# EAGLE design DC_DC_V1.4.2-2(bottom) (EAGLE 7.7.0)
CNAME: DC/DC board for 2016-2017; CREVISION: V1.3; DESIGNER: Sylvia Fu
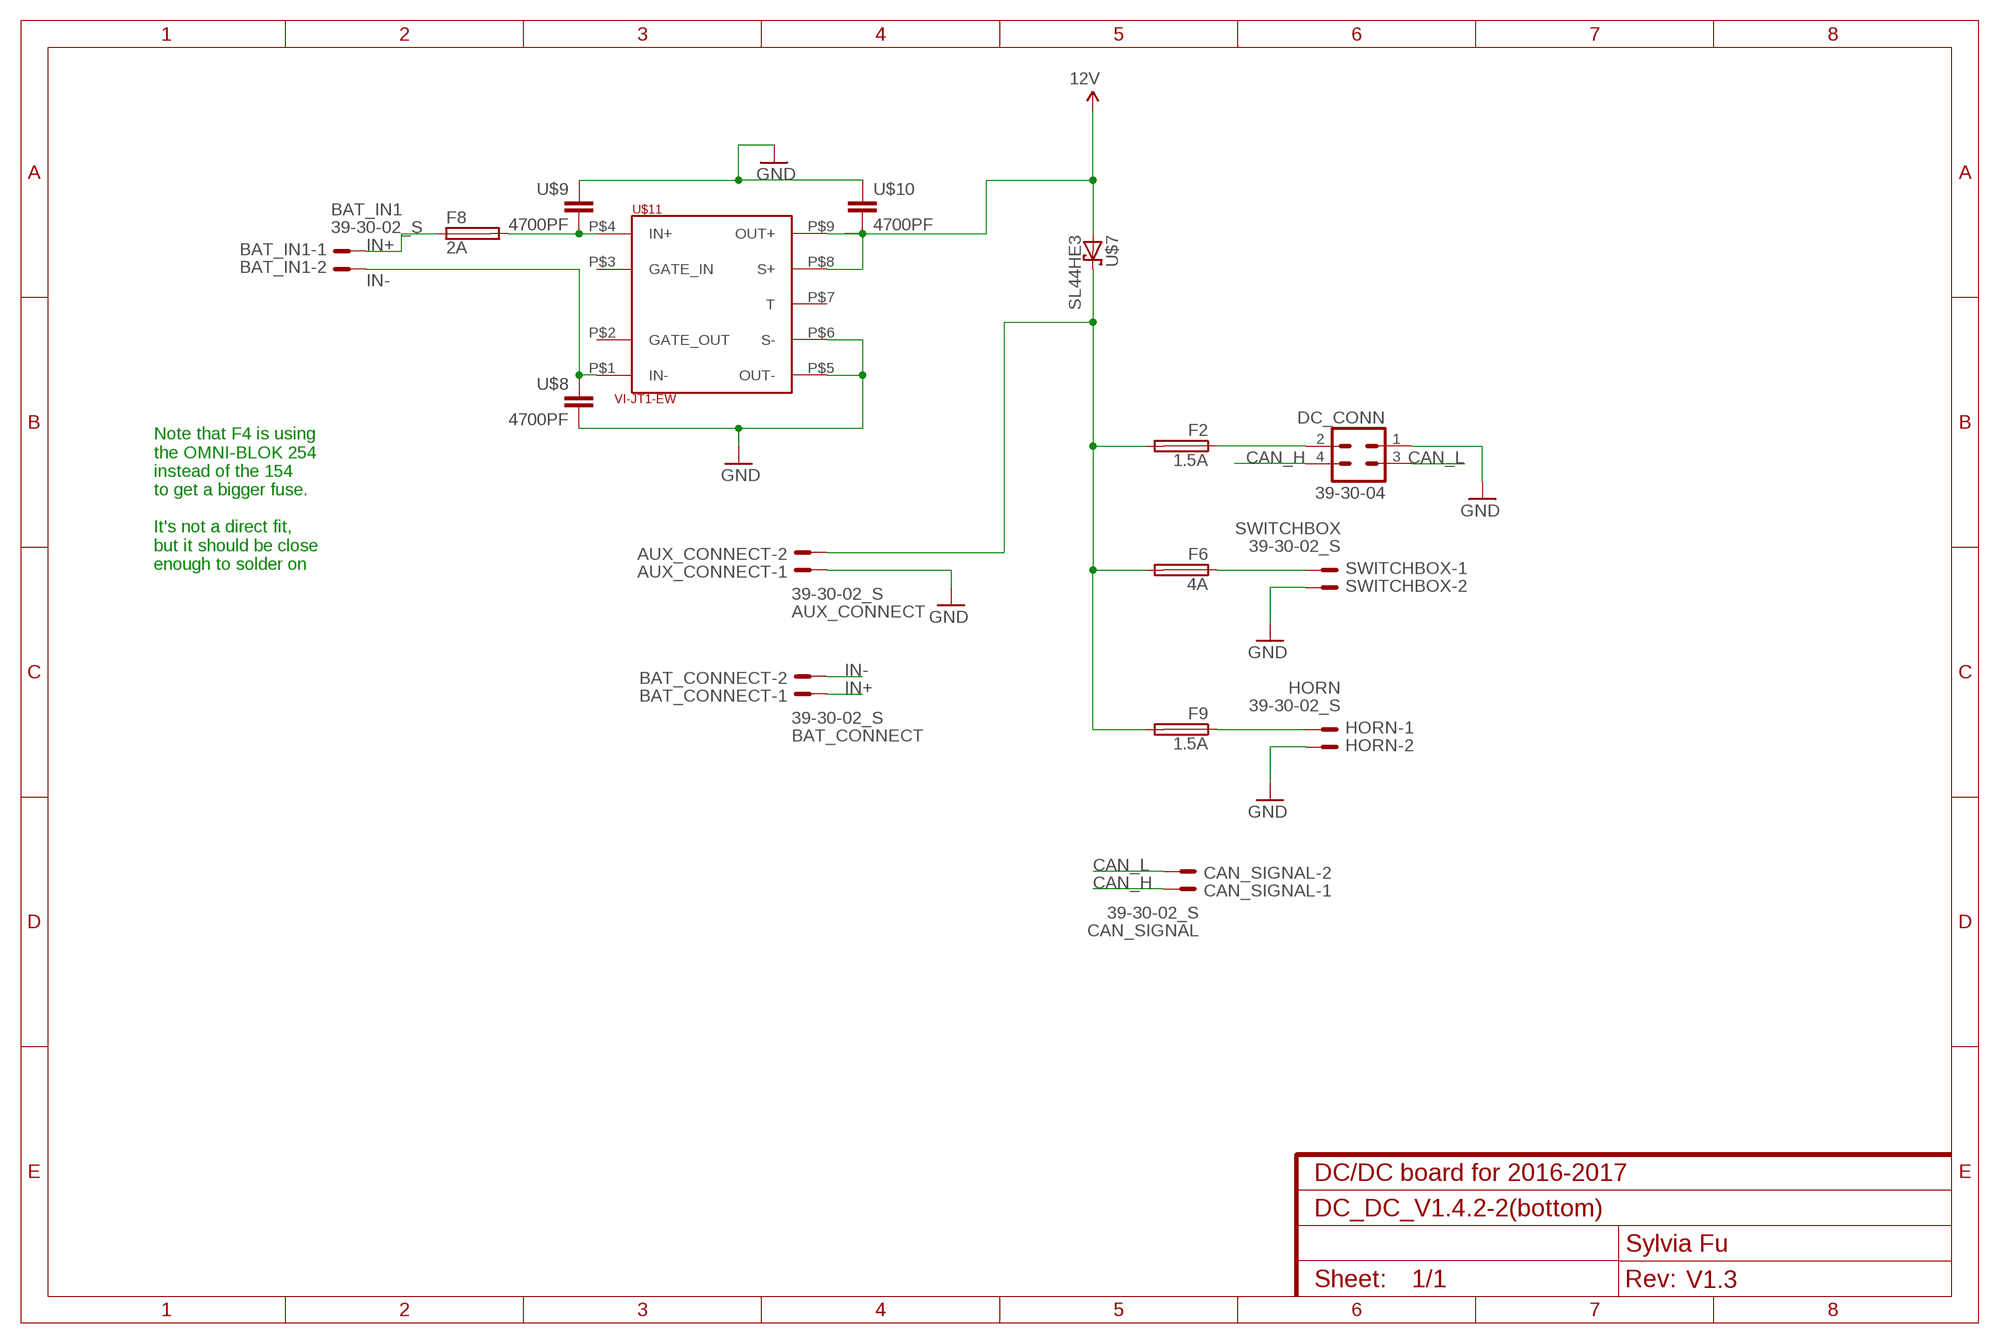
[diagram p0: schematic, sheet 1]

## Parts
AUX_CONNECT  39-30-02_S  [39-30-?02?]
BAT_CONNECT  39-30-02_S  [39-30-?02?]
BAT_IN1  39-30-02_S  [39-30-?02?]
CAN_SIGNAL  39-30-02_S  [39-30-?02?]
DC_CONN  39-30-04  [39-30-?04?]
F2  1.5A  SMD-MICRO-FUSE-BLOCK  [OMNIBLOK]
F6  4A  SMD-MICRO-FUSE-BLOCK  [OMNIBLOK]
F8  2A  SMD-MICRO-FUSE-BLOCK  [OMNIBLOK]
F9  1.5A  SMD-MICRO-FUSE-BLOCK  [OMNIBLOK]
HORN  39-30-02_S  [39-30-?02?]
SWITCHBOX  39-30-02_S  [39-30-?02?]
U$7  SL44HE3  [SMC]
U$8  4700PF  [Y2_CAP]
U$9  4700PF  [Y2_CAP]
U$10  4700PF  [Y2_CAP]
U$11  VI-JT1-EW  [VI-J00]

## Nets
12V: U$7.A U$10.P$2 U$11.P$8(S+) U$11.P$9(OUT+)
CAN_H: CAN_SIGNAL.1 DC_CONN.4
CAN_L: CAN_SIGNAL.2 DC_CONN.3
GND: AUX_CONNECT.1 DC_CONN.1 HORN.2 SWITCHBOX.2 U$8.P$2 U$9.P$1 U$10.P$1 U$11.P$5(OUT-) U$11.P$6(S-)
IN+: BAT_CONNECT.1 BAT_IN1.1 F8.P$1
IN-: BAT_CONNECT.2 BAT_IN1.2 U$8.P$1 U$11.P$1(IN-)
N$1: AUX_CONNECT.2 F2.P$2 F6.P$2 F9.P$2 U$7.C
N$5: DC_CONN.2 F2.P$1
N$8: F6.P$1 SWITCHBOX.1
N$11: F9.P$1 HORN.1
N$12: F8.P$2 U$9.P$2 U$11.P$4(IN+)
Unconnected: U$11.P$2(GATE_OUT) U$11.P$3(GATE_IN) U$11.P$7(T)

## Notes on the sheet
- Note that F4 is using
  the OMNI-BLOK 254
  instead of the 154
  to get a bigger fuse.
  
  It's not a direct fit,
  but it should be close
  enough to solder on

## Library data of the parts
AUX_CONNECT BAT_CONNECT BAT_IN1 CAN_SIGNAL HORN SWITCHBOX = con-molex-mini-fit:39-30-?02?_S: HEADER
DC_CONN = con-molex-mini-fit:39-30-?04?: HEADER
F2 F6 F8 F9 = f-lf-omniblok-s:SMD-MICRO-FUSE
U$7 = diode:SL44HE3
U$8-U$10 = NUSOLAR_Custom:4700PF
U$11 = NUSOLAR_Custom:VI-JT1-EW

## Board
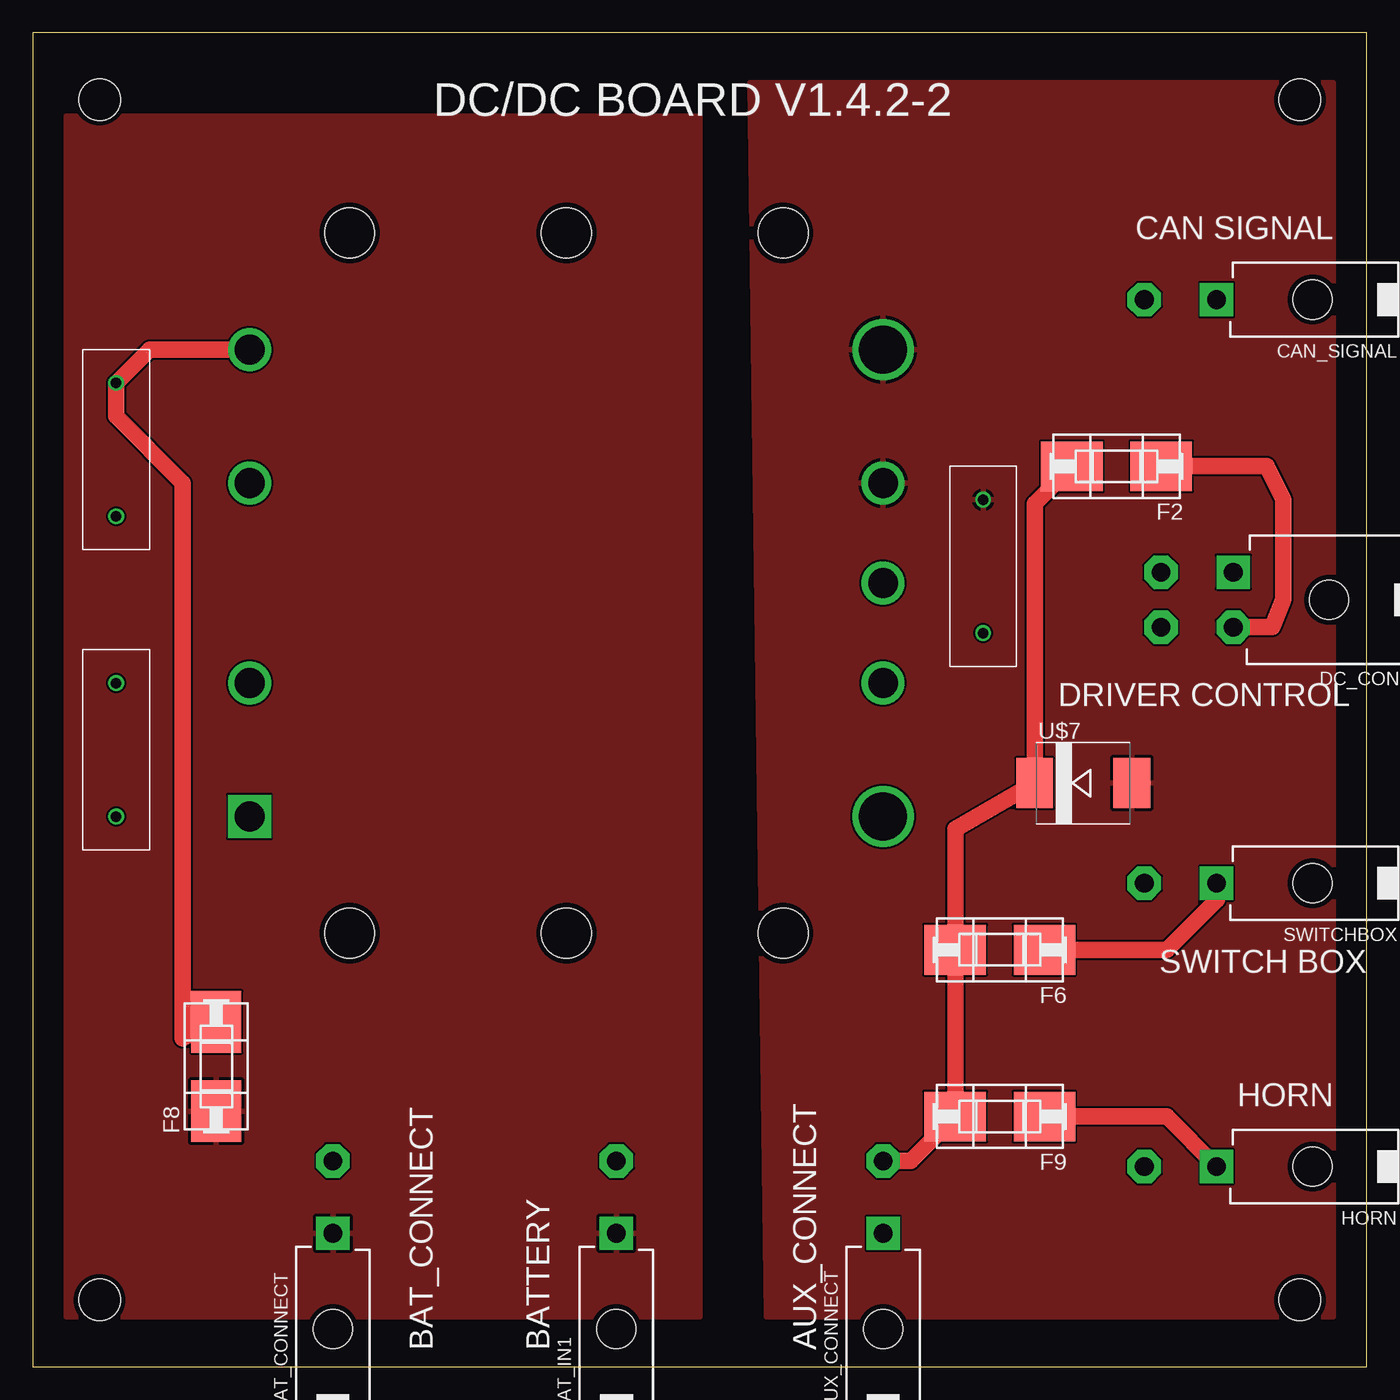
[diagram p1: board, top side]
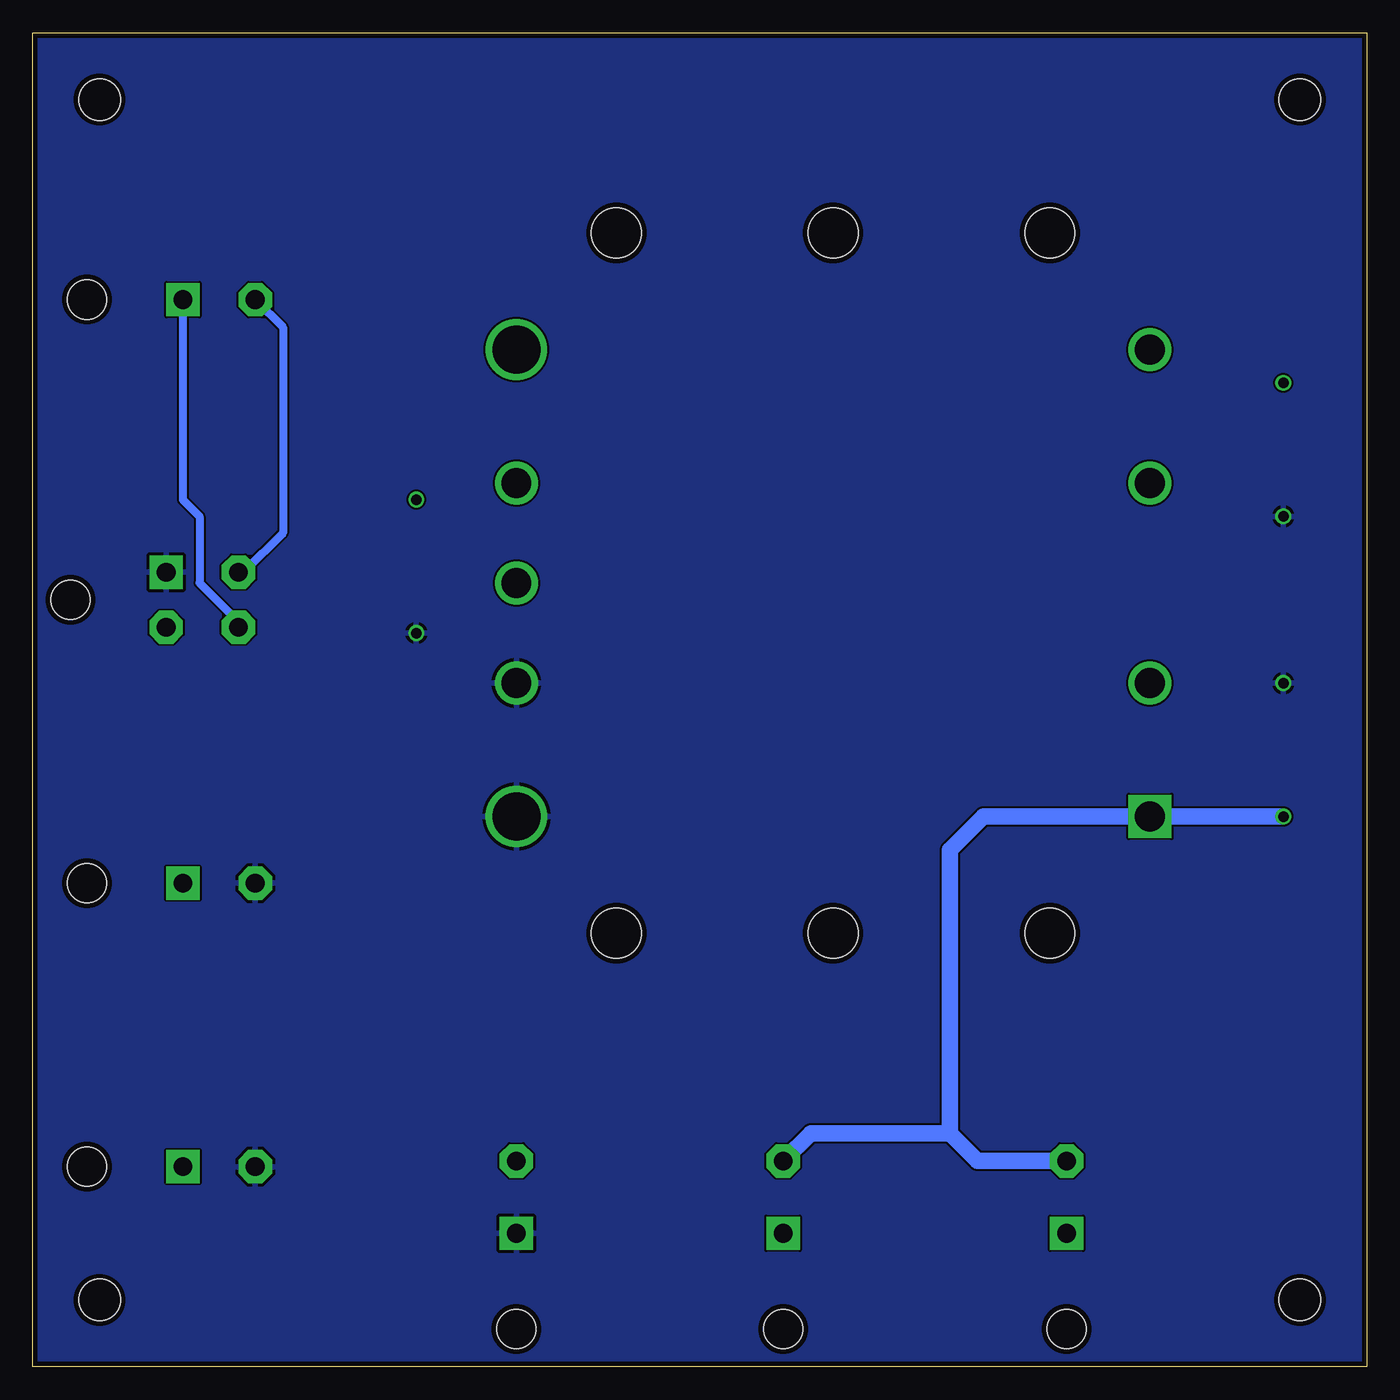
[diagram p2: board, bottom side, seen from below]

Size 101.6 x 101.6 mm. Coordinates in mm from the lower left corner, seen from the top.
Outline: 0,0 101.6,0 101.6,101.6 0,101.6 0,0
Copper layers (1*16): Top 0.0356mm / dielectric 1.5011mm / Bottom 0.0356mm
Design rules "LaenPCBOrder": minimum track width 6mil, minimum drill 13mil, track to track 6mil, track to pad 6mil, pad to pad 6mil, via to via 6mil, smd to smd 6mil, copper to edge 15mil, drill to drill 6mil, minimum pad ring 7mil, minimum via ring 7mil, stop-mask expansion 3mil, vias tented up to drill 0mil, thermal gap 10mil
Holes 3.17 mm at 5.08,96.52 96.52,96.52 96.52,5.08 5.08,5.08

### Footprints (pad centres in the part's own frame; a part is rotated, then mirrored left to right if it is on the bottom)
39-30-?02? = drill 1.422 pad 2.54 square: 1 0,0 | drill 1.422 pad 2.54 octagon: 2 0,5.512 | hole 3: 0,-7.3
39-30-?04? = drill 1.422 pad 2.54 square: 1 2.095,0 | drill 1.422 pad 2.54 octagon: 2 -2.095,0; 3 2.095,5.512; 4 -2.095,5.512 | hole 3: 0,-7.3
OMNIBLOK = smd 4.7 x 3.8: P$1 -3.4,0; P$2 3.4,0
SMC = smd 2.8 x 3.8: A 3.7,0; C -3.7,0
Y2_CAP = drill 0.8: P$1 0,0; P$2 10.16,0
VI-J00 = drill 2.261 square: P$1 0,0 | drill 2.261: P$2 0,10.16; P$3 0,25.4; P$4 0,35.56; P$6 48.26,10.16; P$7 48.26,17.78; P$8 48.26,25.4 | drill 3.658: P$5 48.26,0; P$9 48.26,35.56 | hole 3.81: 7.62,-8.89; 24.13,-8.89; 40.64,-8.89; 40.64,44.45; 24.13,44.45; 7.62,44.45

### Placement (x,y rotation side)
AUX_CONNECT  39-30-02?_S  [39-30-?02?]  64.77,10.16 0 top
BAT_CONNECT  39-30-02?_S  [39-30-?02?]  22.86,10.16 0 top
BAT_IN1  39-30-02?_S  [39-30-?02?]  44.45,10.16 0 top
CAN_SIGNAL  39-30-02?_S  [39-30-?02?]  90.17,81.28 90 top
DC_CONN  39-30-04?  [39-30-?04?]  91.44,58.42 90 top
F2  82.55,68.58 180 top
F6  73.66,31.75 180 top
F8  13.97,22.86 90 top
F9  73.66,19.05 180 top
HORN  39-30-02?_S  [39-30-?02?]  90.17,15.24 90 top
SWITCHBOX  39-30-02?_S  [39-30-?02?]  90.17,36.83 90 top
U$7  80.01,44.45 0 top
U$8  6.35,41.91 90 top
U$9  6.35,64.77 90 top
U$10  72.39,55.88 90 top
U$11  16.51,41.91 0 top

### Tracks (layer width: path | path; a pad name or v marks a point on that pad's centre or on a via)
12V
  pour Top: 54.61,97.79 99.06,97.79 99.06,3.81 55.88,3.81
CAN_H
  Bottom 0.61: CAN_SIGNAL.1 90.17,66.04 88.9,64.77 88.9,59.69 85.93,56.72 DC_CONN.4
CAN_L
  Bottom 0.61: CAN_SIGNAL.2 82.55,79.17 82.55,63.5 85.53,60.52 DC_CONN.3
GND
  pour Bottom: 0,101.6 101.6,101.6 101.6,0 0,0
IN+
  pour Top: 2.54,95.25 50.8,95.25 50.8,3.81 2.54,3.81
IN-
  Bottom 1.27: U$8.P$1 U$11.P$1 29.21,41.91 31.75,39.37 31.75,17.78 | 31.75,17.78 29.64,15.67 BAT_CONNECT.2 | BAT_IN1.2 42.34,17.78 31.75,17.78
N$1
  Top 1.27: AUX_CONNECT.2 66.88,15.67 F9.P$2 F6.P$2 70.26,40.94 U$7.C 76.31,65.74 F2.P$2
N$5
  Top 1.27: F2.P$1 93.98,68.58 95.25,66.04 95.25,58.42 94.42,56.33 DC_CONN.2
N$8
  Top 1.27: F6.P$1 86.36,31.75 90.17,35.56 SWITCHBOX.1
N$11
  Top 1.27: F9.P$1 86.36,19.05 HORN.1
N$12
  Top 1.27: U$11.P$4 8.89,77.47 U$9.P$2 6.35,72.39 11.43,67.31 11.43,24.99 F8.P$2

### Text on the board
tPlace: DC/DC BOARD V1.4.2-2 | CAN SIGNAL | DRIVER CONTROL | SWITCH BOX | HORN | BAT_CONNECT | BATTERY | AUX_CONNECT